# Altium schematic sheet Interface_DSP_FPGA.SchDoc
size A4
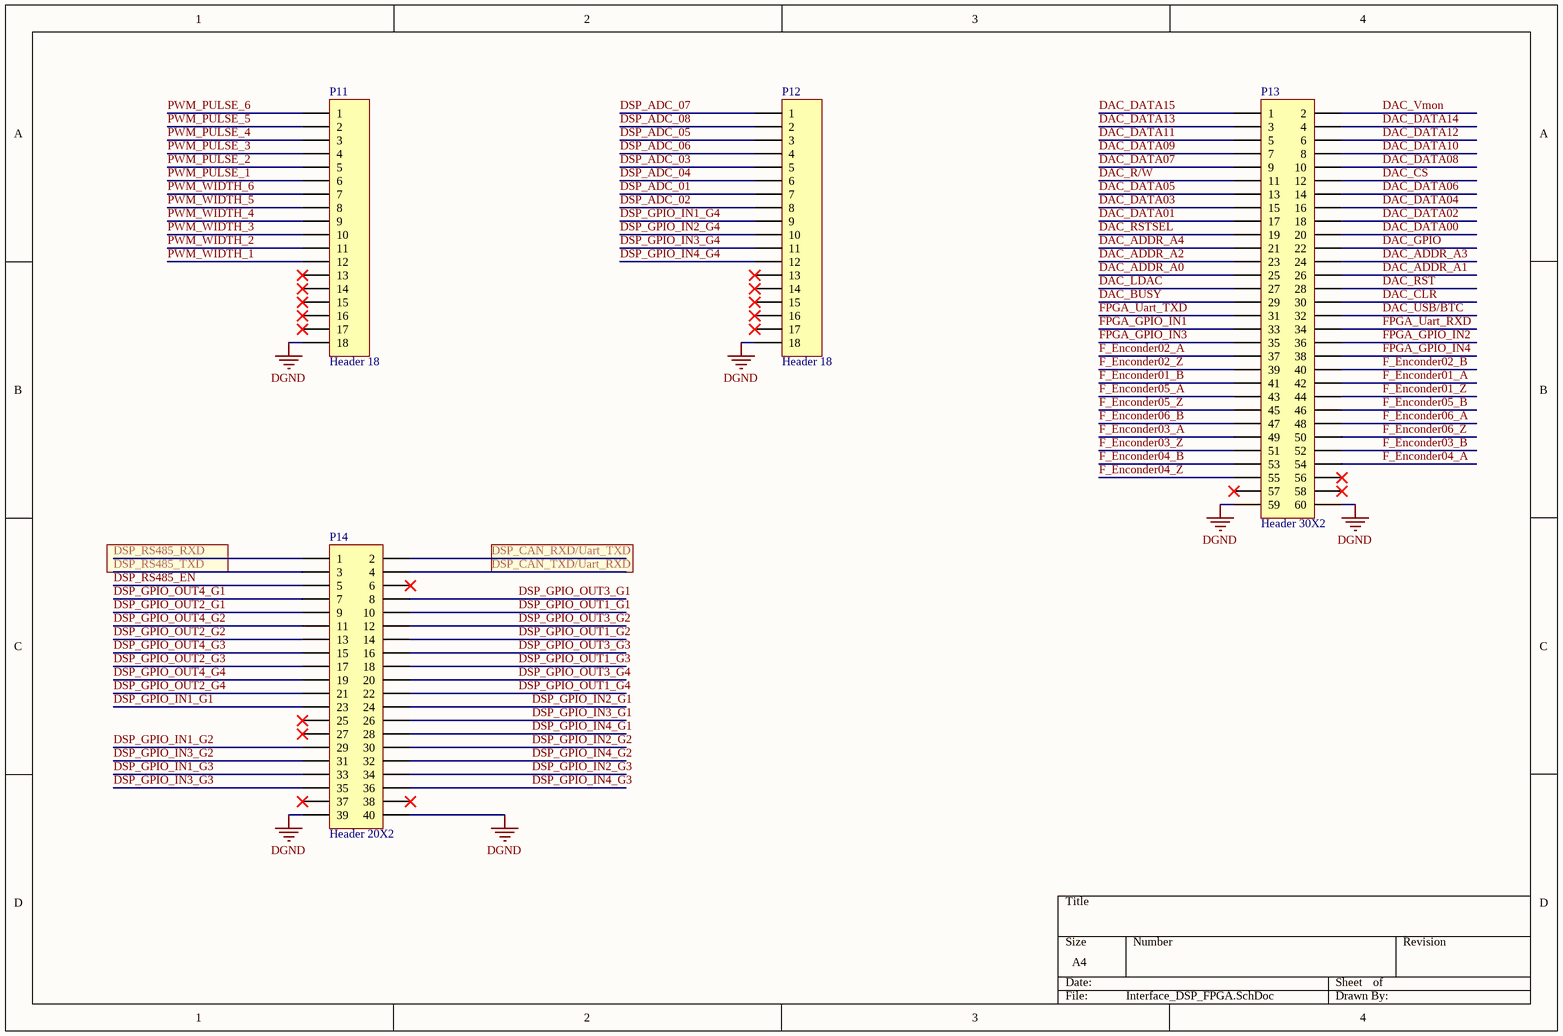
[diagram p0: Interface_DSP_FPGA.SchDoc]

## Parts
P11  Header 18  [HDR1X18]
P12  Header 18  [HDR1X18]
P13  Header 30X2  [HDR2X30]
P14  Header 20X2  [HDR2X20]

## Nets
DGND: P11.18 P12.18 P13.59 P13.60 P14.39 P14.40
DAC_ADDR_A0: P13.25
DAC_ADDR_A1: P13.26
DAC_ADDR_A2: P13.23
DAC_ADDR_A3: P13.24
DAC_ADDR_A4: P13.21
DAC_BUSY: P13.29
DAC_CLR: P13.30
DAC_CS: P13.12
DAC_DATA00: P13.20
DAC_DATA01: P13.17
DAC_DATA02: P13.18
DAC_DATA03: P13.15
DAC_DATA04: P13.16
DAC_DATA05: P13.13
DAC_DATA06: P13.14
DAC_DATA07: P13.9
DAC_DATA08: P13.10
DAC_DATA09: P13.7
DAC_DATA10: P13.8
DAC_DATA11: P13.5
DAC_DATA12: P13.6
DAC_DATA13: P13.3
DAC_DATA14: P13.4
DAC_DATA15: P13.1
DAC_GPIO: P13.22
DAC_LDAC: P13.27
DAC_R/W: P13.11
DAC_RST: P13.28
DAC_RSTSEL: P13.19
DAC_USB/BTC: P13.32
DAC_Vmon: P13.2
DSP_ADC_01: P12.7
DSP_ADC_02: P12.8
DSP_ADC_03: P12.5
DSP_ADC_04: P12.6
DSP_ADC_05: P12.3
DSP_ADC_06: P12.4
DSP_ADC_07: P12.1
DSP_ADC_08: P12.2
DSP_CAN_RXD/Uart_TXD: P14.2
DSP_CAN_TXD/Uart_RXD: P14.4
DSP_GPIO_IN1_G1: P14.23
DSP_GPIO_IN1_G2: P14.29
DSP_GPIO_IN1_G3: P14.33
DSP_GPIO_IN1_G4: P12.9
DSP_GPIO_IN2_G1: P14.24
DSP_GPIO_IN2_G2: P14.30
DSP_GPIO_IN2_G3: P14.34
DSP_GPIO_IN2_G4: P12.10
DSP_GPIO_IN3_G1: P14.26
DSP_GPIO_IN3_G2: P14.31
DSP_GPIO_IN3_G3: P14.35
DSP_GPIO_IN3_G4: P12.11
DSP_GPIO_IN4_G1: P14.28
DSP_GPIO_IN4_G2: P14.32
DSP_GPIO_IN4_G3: P14.36
DSP_GPIO_IN4_G4: P12.12
DSP_GPIO_OUT1_G1: P14.10
DSP_GPIO_OUT1_G2: P14.14
DSP_GPIO_OUT1_G3: P14.18
DSP_GPIO_OUT1_G4: P14.22
DSP_GPIO_OUT2_G1: P14.9
DSP_GPIO_OUT2_G2: P14.13
DSP_GPIO_OUT2_G3: P14.17
DSP_GPIO_OUT2_G4: P14.21
DSP_GPIO_OUT3_G1: P14.8
DSP_GPIO_OUT3_G2: P14.12
DSP_GPIO_OUT3_G3: P14.16
DSP_GPIO_OUT3_G4: P14.20
DSP_GPIO_OUT4_G1: P14.7
DSP_GPIO_OUT4_G2: P14.11
DSP_GPIO_OUT4_G3: P14.15
DSP_GPIO_OUT4_G4: P14.19
DSP_RS485_EN: P14.5
DSP_RS485_RXD: P14.1
DSP_RS485_TXD: P14.3
F_Enconder01_A: P13.42
F_Enconder01_B: P13.41
F_Enconder01_Z: P13.44
F_Enconder02_A: P13.37
F_Enconder02_B: P13.40
F_Enconder02_Z: P13.39
F_Enconder03_A: P13.49
F_Enconder03_B: P13.52
F_Enconder03_Z: P13.51
F_Enconder04_A: P13.54
F_Enconder04_B: P13.53
F_Enconder04_Z: P13.55
F_Enconder05_A: P13.43
F_Enconder05_B: P13.46
F_Enconder05_Z: P13.45
F_Enconder06_A: P13.48
F_Enconder06_B: P13.47
F_Enconder06_Z: P13.50
FPGA_GPIO_IN1: P13.33
FPGA_GPIO_IN2: P13.36
FPGA_GPIO_IN3: P13.35
FPGA_GPIO_IN4: P13.38
FPGA_Uart_RXD: P13.34
FPGA_Uart_TXD: P13.31
PWM_PULSE_1: P11.6
PWM_PULSE_2: P11.5
PWM_PULSE_3: P11.4
PWM_PULSE_4: P11.3
PWM_PULSE_5: P11.2
PWM_PULSE_6: P11.1
PWM_WIDTH_1: P11.12
PWM_WIDTH_2: P11.11
PWM_WIDTH_3: P11.10
PWM_WIDTH_4: P11.9
PWM_WIDTH_5: P11.8
PWM_WIDTH_6: P11.7

Not connected (* = marked no-connect by the designer): P11 13* 14* 15* 16* 17*; P12 13* 14* 15* 16* 17*; P13 56* 57* 58*; P14 6* 25* 27* 37* 38*

## Library data of the parts
P11 P12 = Header 18: Header, 18-Pin; LatestRevisionDate: 17-Jul-2002; LatestRevisionNote: Re-released for DXP Platform.; Publisher: Altium Limited
P13 = Header 30X2: Header, 30-Pin, Dual row; LatestRevisionDate: 17-Jul-2002; LatestRevisionNote: Re-released for DXP Platform.; Publisher: Altium Limited
P14 = Header 20X2: Header, 20-Pin, Dual row; LatestRevisionDate: 17-Jul-2002; LatestRevisionNote: Re-released for DXP Platform.; Publisher: Altium Limited